# EAGLE design Schematic (EAGLE 9.4.0)
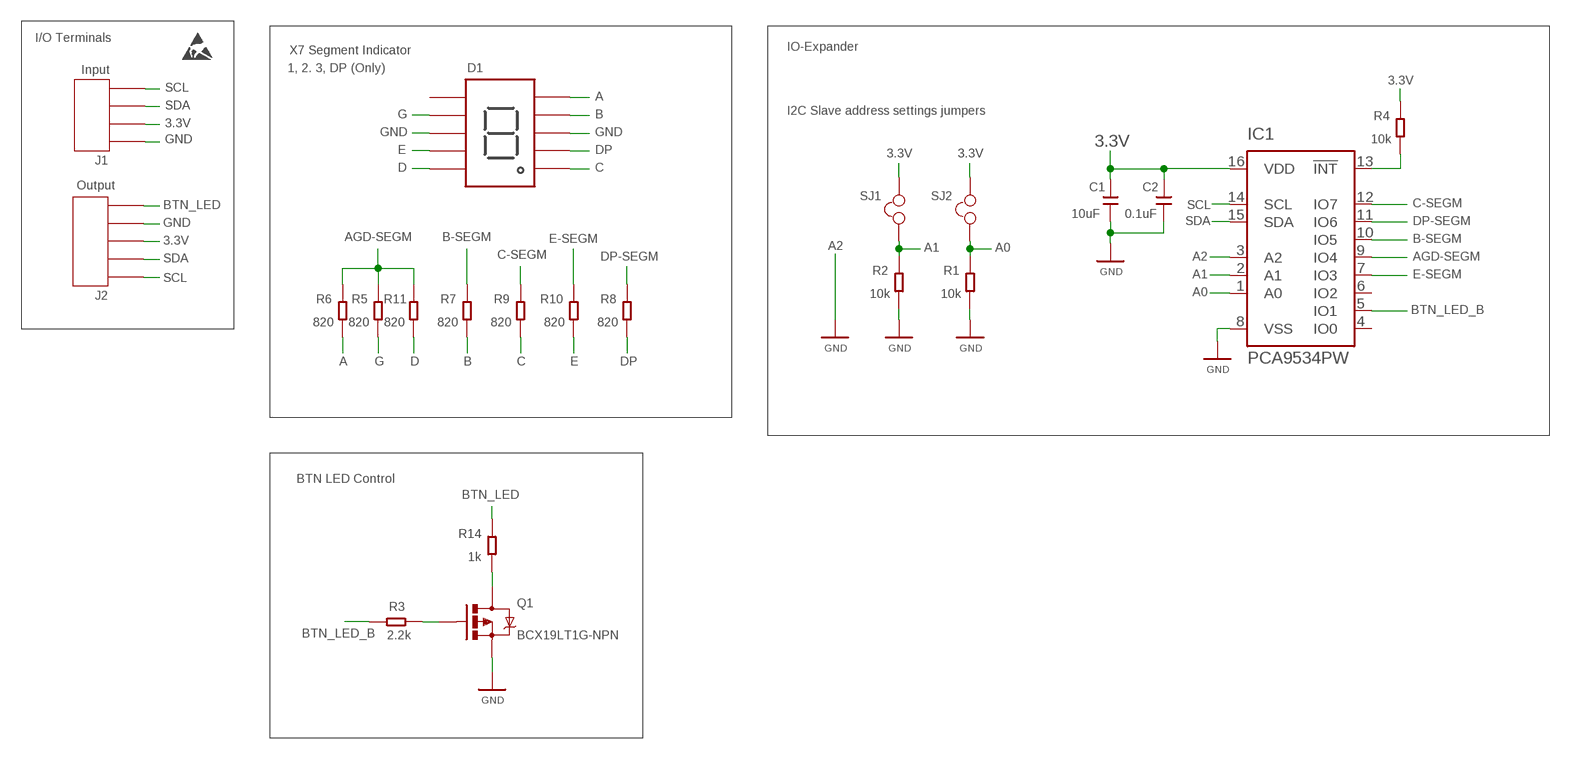
[diagram p0: schematic, sheet 1]

## Parts
C1  10uF  SMD-CAP-0805  [SMD-CAP-0805]
C2  0.1uF  SMD-CAP-0805  [SMD-CAP-0805]
D1  GNS-3011CS-21  [GNS-3011CS-21]
IC1  PCA9534PW  [TSSOP16]
J1  Input  WF-4R  [WF-4R]
J2  Output  WF-5R  [WF-5R]
Q1  MOSFET-PCHANNEL  [SOT23-3]
R1  10k  SMD-RES-0603  [SMD-RES-0603]
R2  10k  SMD-RES-0603  [SMD-RES-0603]
R3  2.2k  SMD-RES-0603  [SMD-RES-0603]
R4  10k  SMD-RES-0603  [SMD-RES-0603]
R5  820  SMD-RES-0603  [SMD-RES-0603]
R6  820  SMD-RES-0603  [SMD-RES-0603]
R7  820  SMD-RES-0603  [SMD-RES-0603]
R8  820  SMD-RES-0603  [SMD-RES-0603]
R9  820  SMD-RES-0603  [SMD-RES-0603]
R10  820  SMD-RES-0603  [SMD-RES-0603]
R11  820  SMD-RES-0603  [SMD-RES-0603]
R14  1k  SMD-RES-0603  [SMD-RES-0603]
SJ1  SOLDER-JUMPER  [SOLDER-JUMPER]
SJ2  SOLDER-JUMPER  [SOLDER-JUMPER]
U$2  ESD-LOGO  [ESD-LOGO]

## Nets
3.3V: C1.2 C2.2 IC1.16(VDD) J1.P$2 J2.P$3 R4.2 SJ1.P$2 SJ2.P$2
A: D1.A R6.1
A0: IC1.1(A0) R1.2 SJ2.P$1
A1: IC1.2(A1) R2.2 SJ1.P$1
A2: IC1.3(A2) ; supply symbol labelled GND
AGD-SEGM: IC1.9(IO4) R5.2 R6.2 R11.2
B: D1.B R7.1
B-SEGM: IC1.10(IO5) R7.2
BTN_LED: J2.P$5 R14.2
BTN_LED_B: IC1.5(IO1) R3.2
C: D1.C R9.1
C-SEGM: IC1.12(IO7) R9.2
D: D1.D R11.1
DP: D1.DP R8.1
DP-SEGM: IC1.11(IO6) R8.2
E: D1.E R10.1
E-SEGM: IC1.7(IO3) R10.2
G: D1.G R5.1
GND: C1.1 C2.1 D1.CATHODE_1 D1.CATHODE_2 IC1.8(VSS) J1.P$1 J2.P$4 Q1.2(S) R1.1 R2.1
N$1: IC1.13(!INT) R4.1
N$2: Q1.3(D) R14.1
N$3: Q1.1(G) R3.1
SCL: IC1.14(SCL) J1.P$4 J2.P$1
SDA: IC1.15(SDA) J1.P$3 J2.P$2
Unconnected: D1.F IC1.4(IO0) IC1.6(IO2)

## Notes on the sheet
- I/O Terminals
- IO-Expander
- X7 Segment Indicator
- 1, 2. 3, DP (Only)
- I2C Slave address settings jumpers
- BTN LED Control
- BCX19LT1G-NPN

## Library data of the parts
C1 C2 = Network_Board Lib:SMD-CAP-0805
D1 = Elevator:GNS-3011CS-21: GNS-3011CS-21 - X7 Segment LED indicator Common Cathode
IC1 = micro-philips:PCA9534: 8-bit I2C-bus and SMBus low power I/O port with interrupt Source: www.nxp.com .. PCA9534_3.pdf; MPN: PCA9534PW; OC_FARNELL: 1408285; OC_NEWARK: 18M7516
J1 = Elevator:WF-4R: WF-4R - Socket x4 pins Step - 2.54
J2 = Elevator:WF-5R: WF-5R - Socket x5 pins Step - 2.54
Q1 = User-Submitted:MOSFET-PCHANNEL: Generic PMOSFET IRLML2244 - TRANS-11153 (SOT-23 -20V -4.3A) (1.Gate 2.Source 3.Drain) FQP27P06 - COM-10349 <http://www.sparkfun.com/products/10349> (TO-220 -60V -27A) (1.Gate 2.Source 3.Drain); PROD_ID: TRANS-08285
R1-R11 R14 = Network_Board Lib:SMD-RES-0603: SMD Resistor 0603 Size Reccomended for use. Vishay design source
SJ1 SJ2 = Elevator:SOLDER-JUMPER: Solder Jumper
U$2 = Network_Board Lib:ESD-LOGO

## Board
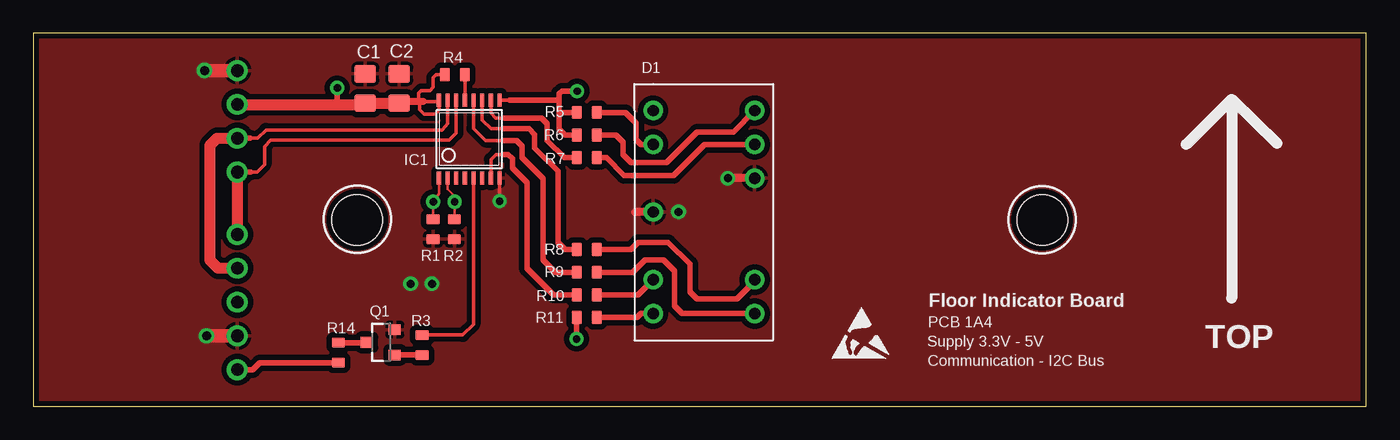
[diagram p1: board, top side]
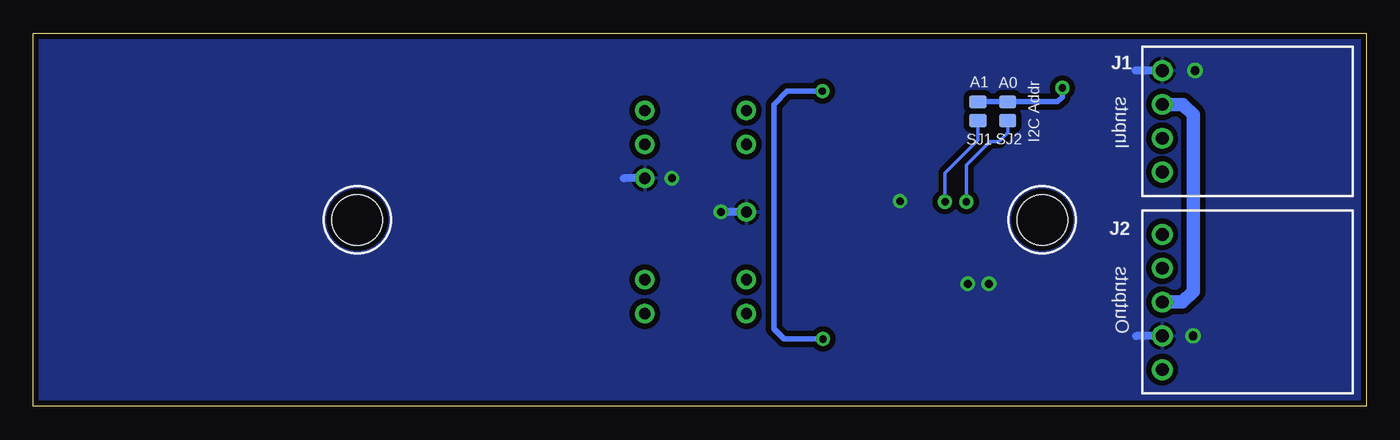
[diagram p2: board, bottom side, seen from below]

Size 100 x 28 mm. Coordinates in mm from the lower left corner, seen from the top.
Outline: 0,0 100,0 100,28 0,28 0,0
Copper layers (1*16): Top 0.035mm / dielectric 1.5mm / Bottom 0.035mm
Design rules "SparkFun PCB Checker": minimum track width 8mil, minimum drill 20mil, track to track 8mil, track to pad 8mil, pad to pad 8mil, via to via 8mil, smd to smd 8mil, copper to edge 8mil, drill to drill 8mil, minimum pad ring 12mil, minimum via ring 10mil, stop-mask expansion 4mil, vias tented up to drill 20mil, thermal gap 10mil
Holes 3.8 mm at 24.3,14 75.7,14

### Footprints (pad centres in the part's own frame; a part is rotated, then mirrored left to right if it is on the bottom)
SMD-CAP-0805 = smd 1.6 x 1.3: 1 0,1.1; 2 0,-1.1
GNS-3011CS-21 = drill 0.85: A 7.62,0; B 7.62,-2.54; C 7.62,-15.24; CATHODE_1 0,-7.62; CATHODE_2 7.62,-5.08; D 0,-15.24; DP 7.62,-12.7; E 0,-12.7; F 0,0; G 0,-2.54
TSSOP16 = smd 0.305 x 0.991: 1 -2.275,-2.918; 2 -1.625,-2.918; 3 -0.975,-2.918; 4 -0.325,-2.918; 5 0.325,-2.918; 6 0.975,-2.918; 7 1.625,-2.918; 8 2.275,-2.918; 9 2.275,2.918; 10 1.625,2.918; 11 0.975,2.918; 12 0.325,2.918; 13 -0.325,2.918; 14 -0.975,2.918; 15 -1.625,2.918; 16 -2.275,2.918
WF-4R = drill 0.95: P$1 0,0; P$2 2.54,0; P$3 5.08,0; P$4 7.62,0
WF-5R = drill 0.95: P$1 0,0; P$2 2.54,0; P$3 5.08,0; P$4 7.62,0; P$5 10.16,0
SOT23-3 = smd 0.8 x 0.9: 1 -0.95,-1; 2 0.95,-1; 3 0,1.1
SMD-RES-0603 = smd 0.75 x 1: 1 -0.76,0.04; 2 0.74,0.04
SOLDER-JUMPER = smd 1 x 1.3: P$1 0,0; P$2 1.4,0

### Placement (x,y rotation side)
C1  24.9,23.85 0 top
C2  27.45,23.85 0 top
D1  46.5,22.2 0 top
IC1  32.7,20.06 0 top
J1  15.3,25.2 270 bottom
J2  15.3,12.9 270 bottom
Q1  26.11,4.8 90 top
R1  30.03,13.3 90 top
R2  31.63,13.3 90 top
R3  29.22,4.6 90 top
R4  31.6,24.94 180 top
R5  41.5,22.1 180 top
R6  41.5,20.4 180 top
R7  41.5,18.7 180 top
R8  41.5,11.8 180 top
R9  41.5,10.1 180 top
R10  41.5,8.4 180 top
R11  41.5,6.7 180 top
R14  22.85,4 270 top
SJ1  29.13,21.45 90 bottom
SJ2  26.9,21.45 90 bottom
U$2  59.73,3.27 0 top

### Tracks (layer width: path | path; a pad name or v marks a point on that pad's centre or on a via)
3.3V  (via drill 0.55)
  Top 0.254: 28.98,22.88 28.98,22.28 29.3,21.95 30.14,21.95 30.43,22.23 IC1.16 30.32,22.88 29.28,22.88 | R4.2 30.23,24.9 30,24.68 30,23.95 29.75,23.7 29.1,23.7 28.9,23.5 28.9,22.88
  Top 0.406: 22.8,22.66 v22.8,23.9
  Top 0.508: C2.2 27.05,22.88 28.9,22.88 28.98,22.88 29.28,22.88
  Top 0.813: J1.P$2 22.8,22.66 24.49,22.66 C1.2 C2.2
  Bottom 0.406: v22.8,23.9 22.8,23.2 23.15,22.85 SJ2.P$2 SJ1.P$2
  Bottom 1.016: J1.P$2 13.76,22.66 12.98,21.89 12.98,8.62 13.78,7.82 J2.P$3
A
  Top 0.406: R6.1 43.72,20.36 44.25,19.83 44.25,18.9 44.85,18.3 47.5,18.3 49.8,20.6 52.52,20.6 D1.A
A0  (via drill 0.55)
  Top 0.203: IC1.1 30.43,15.97 v30,15.35 30,14.41 R1.2
  Bottom 0.254: SJ2.P$1 26.9,20.53 27.54,19.89 28.22,19.89 29.98,18.12 29.98,15.37 v30,15.35
A1  (via drill 0.55)
  Top 0.203: IC1.2 31.07,16.32 31.6,15.8 v31.6,15.35 31.6,14.42 R2.2
  Bottom 0.254: SJ1.P$1 29.13,19.97 31.6,17.5 v31.6,15.35
AGD-SEGM  (via drill 0.55)
  Top 0.254: 35.75,22.98 IC1.9
  Top 0.406: R11.2 v40.76,5.05 | 39.45,22.1 39.45,20.8 39.89,20.36 R6.2 | R5.2 39.49,22.06 39.45,22.1 | 39.45,22.1 39.45,22.98 | 39.45,22.98 39.45,23.45 39.65,23.65 v40.81,23.65 | 39.45,22.98 35.75,22.98
  Bottom 0.406: v40.76,5.05 43.7,5.05 44.45,5.8 44.45,22.65 43.45,23.65 v40.81,23.65
B
  Top 0.406: R7.1 43,18.66 44.33,17.34 48.03,17.34 50.36,19.66 D1.B
B-SEGM
  Top 0.254: IC1.10 34.33,22.02 34.7,21.65 35.3,21.65
  Top 0.406: 35.3,21.65 38.13,21.65 38.55,21.23 38.55,19.95 39.84,18.66 R7.2
BTN_LED
  Top 0.406: J2.P$5 16.44,2.74 16.96,3.26 R14.2
BTN_LED_B
  Top 0.254: IC1.5 33.02,6.16 32.21,5.34 R3.2
C
  Top 0.406: D1.C 48.69,6.96 48.12,7.52 48.12,10.17 47.3,11 45.9,11 44.96,10.06 R9.1
C-SEGM
  Top 0.254: IC1.12 33.02,20.85 33.92,19.95 35.28,19.95
  Top 0.406: 35.28,19.95 36.25,19.95 36.67,19.52 36.67,18.65 38.25,17.08 38.25,11 39.19,10.06 R9.2
D
  Top 0.406: D1.D 45.61,6.96 45.31,6.66 R11.1
DP
  Top 0.406: R8.1 44.84,11.76 45.38,12.3 47.62,12.3 49.25,10.66 49.25,8.57 49.78,8.05 52.8,8.05 54.12,9.37 D1.DP
DP-SEGM
  Top 0.254: IC1.11 33.67,21.5 34.35,20.83 35.28,20.83
  Top 0.406: 35.28,20.83 37.2,20.83 37.62,20.4 37.62,19.38 39.35,17.65 39.35,12.3 39.89,11.76 R8.2
E
  Top 0.406: D1.E 45.36,8.36 R10.1
E-SEGM
  Top 0.254: 35.23,18.9 34.7,18.9 34.33,18.52 IC1.7
  Top 0.406: R10.2 39.04,8.36 37.05,10.35 37.05,16.8 35.95,17.9 35.95,18.58 35.63,18.9 35.23,18.9
G
  Top 0.406: R5.1 44.43,22.06 45.23,21.26 45.23,20.02 45.59,19.66 D1.G
GND  (via drill 0.55, 0.6, 0.65)
  Top 0.254: IC1.8 v34.98,15.4
  Top 0.61: D1.CATHODE_2 v52.1,17.12 | D1.CATHODE_1 45.15,14.58
  Top 1.016: J1.P$1 v12.85,25.2 | J2.P$4 v13,5.28
  Bottom 0.61: D1.CATHODE_1 46.52,14.6 v48.4,14.6 | D1.CATHODE_2 55.7,17.12 | J2.P$4 17.25,5.28 | J1.P$1 17.3,25.2
  other vias: 28.3,9.2 29.9,9.2
  pour Top (isolate 0.406): 0,28 100,28 100,0 0,0
  pour Bottom (isolate 0.406): 0,28 100,28 100,0 0,0
N$1
  Top 0.254: R4.1 32.38,24.89 IC1.13
N$2
  Top 0.406: Q1.3 24.97,4.76 R14.1
N$3
  Top 0.406: Q1.1 R3.1
SCL
  Top 0.254: IC1.14 31.73,20.5 31.2,19.97 17.82,19.97 17.35,19.5 17.35,18.15 16.78,17.58 16.3,17.58
  Top 0.406: 16.3,17.58 J1.P$4
  Top 0.813: J1.P$4 J2.P$1
SDA
  Top 0.254: IC1.15 31.07,21.21 30.95,21.05 30.65,20.75 17.45,20.75 16.82,20.12 16.25,20.12
  Top 0.406: J1.P$3 16.25,20.12
  Top 0.813: J2.P$2 13.85,10.36 13.26,10.95 13.26,19.59 13.79,20.12 J1.P$3

### Text on the board
tPlace: Floor Indicator Board | PCB 1A4 | Supply 3.3V - 5V | TOP | Communication - I2C Bus
bNames: I2C Addr | A0 | A1 | Inputs | Outputs